# EAGLE design v1.3 (EAGLE 7.3.0)
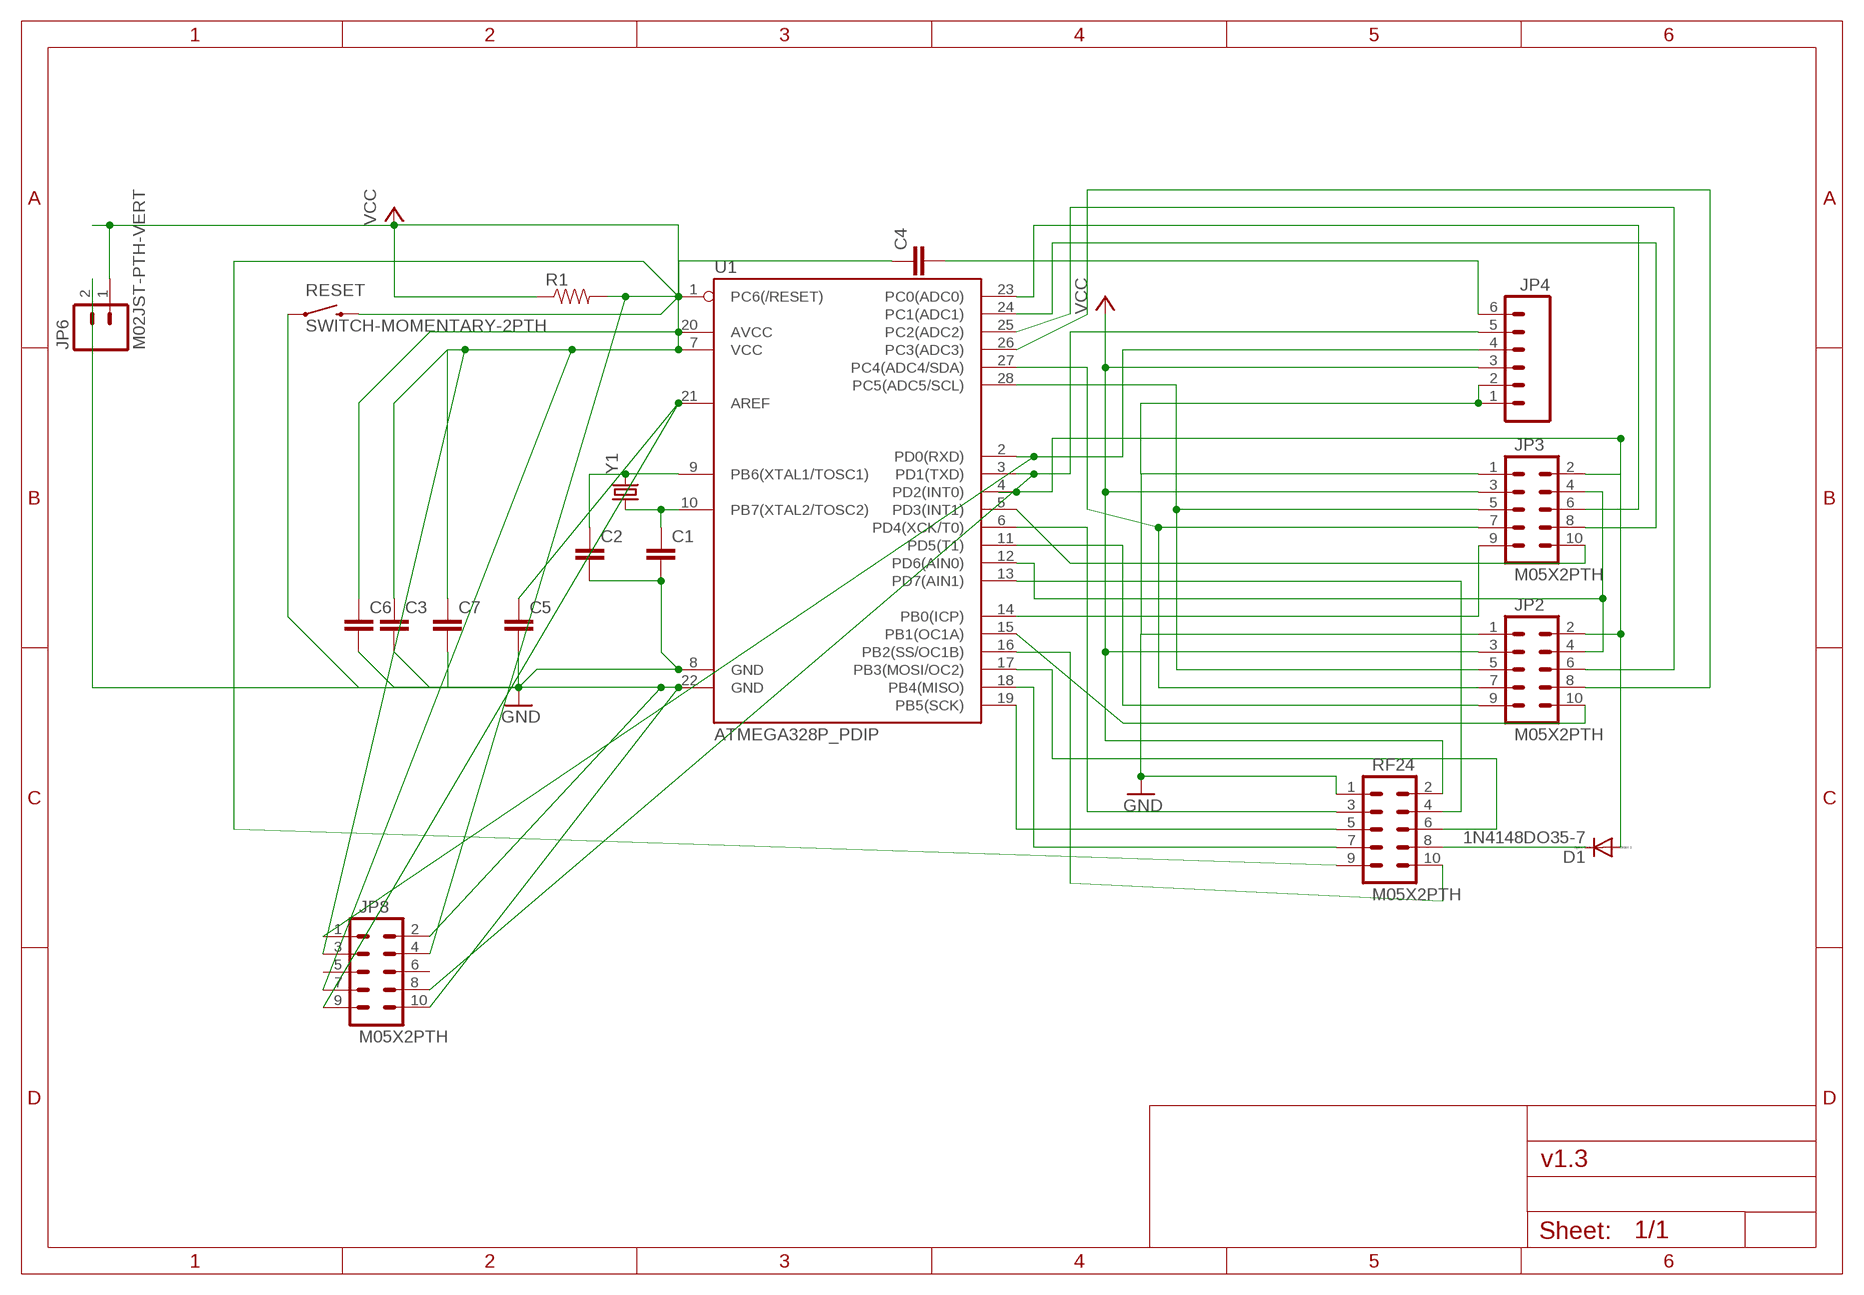
[diagram p0: schematic, sheet 1]

## Parts
C1  CAPPTH  [CAP-PTH-SMALL]
C2  CAPPTH  [CAP-PTH-SMALL]
C3  CAPPTH  [CAP-PTH-SMALL]
C4  CAPPTH  [CAP-PTH-SMALL]
C5  CAPPTH  [CAP-PTH-SMALL]
C6  CAPPTH  [CAP-PTH-SMALL]
C7  CAPPTH  [CAP-PTH-SMALL]
D1  1N4148DO35-7  [DO35-7]
JP2  M05X2PTH  [AVR_ICSP]
JP3  M05X2PTH  [AVR_ICSP]
JP4  M06SILK_FEMALE_PTH  [1X06]
JP6  M02JST-PTH-VERT  [JST-2-PTH-VERT]
JP8  M05X2PTH  [AVR_ICSP]
R1  RESISTORAXIAL-0.3  [AXIAL-0.3]
RESET  SWITCH-MOMENTARY-2PTH  [TACTILE-PTH]
RF24  M05X2PTH  [AVR_ICSP]
U1  ATMEGA328P_PDIP  [DIL28-3]
Y1  CRYSTALHC49US  [HC49US]

## Nets
GND: C1.2 C2.2 C3.2 C5.2 C6.2 C7.2 JP2.1 JP3.1 JP4.1 JP4.2 JP6.2 JP8.2 JP8.10 RESET.1 RF24.1 U1.8(GND) U1.22(GND)
N$1: C2.1 U1.9(PB6(XTAL1/TOSC1)) Y1.2
N$2: C4.1 JP8.4 R1.P$2 RESET.3 RF24.9 U1.1(PC6(/RESET))
N$3: C1.1 U1.10(PB7(XTAL2/TOSC2)) Y1.1
N$4: RF24.10 U1.16(PB2(SS/OC1B))
N$5: JP2.4 JP3.4 U1.12(PD6(AIN0))
N$6: C5.1 JP8.9 U1.21(AREF)
N$9: JP3.9 U1.14(PB0(ICP))
N$10: D1.A JP2.2 JP3.2 U1.4(PD2(INT0))
N$11: JP3.6 U1.23(PC0(ADC0))
N$12: JP3.8 U1.24(PC1(ADC1))
N$13: C4.2 JP4.6
N$14: JP2.6 U1.25(PC2(ADC2))
N$15: JP2.8 U1.26(PC3(ADC3))
N$16: RF24.6 U1.17(PB3(MOSI/OC2))
N$17: JP3.10 U1.5(PD3(INT1))
N$18: JP4.5 JP8.8 U1.3(PD1(TXD))
N$19: JP4.4 JP8.1 U1.2(PD0(RXD))
N$20: RF24.4 U1.13(PD7(AIN1))
N$21: JP2.5 JP3.5 U1.28(PC5(ADC5/SCL))
N$22: JP2.7 JP3.7 U1.27(PC4(ADC4/SDA))
N$23: RF24.5 U1.19(PB5(SCK))
N$24: D1.C RF24.8
N$25: RF24.3 U1.6(PD4(XCK/T0))
N$26: RF24.7 U1.18(PB4(MISO))
N$27: JP2.10 U1.15(PB1(OC1A))
N$28: JP2.9 U1.11(PD5(T1))
VCC: C3.1 C6.1 C7.1 JP2.3 JP3.3 JP4.3 JP6.1 JP8.3 JP8.7 R1.P$1 RF24.2 U1.7(VCC) U1.20(AVCC)
Unconnected: JP8.5 JP8.6

## Library data of the parts
C1-C7 = SparkFun-Passives:CAP: Capacitor Standard 0603 ceramic capacitor, and 0.1" leaded capacitor.
D1 = diode:1N4148: DIODE high speed (Philips)
JP2 JP3 JP8 RF24 = SparkFun-Connectors:M05X2: Header 5x2 Standard 10-pin dual row 0.1" header. Commonly used with AVR-ISP. Use with Spark Fun Electronics SKU: PRT-00778
JP4 = SparkFun-Connectors:M06: Header 6 Standard 6-pin 0.1" header. Use with straight break away headers (SKU : PRT-00116), right angle break away headers (PRT-00553), swiss pins (PRT-00743), machine pins (PRT-00117), and female headers (PRT-00115). Molex polarized connector foot print use with SKU : PRT-08094 with associated crimp pins and housings. NOTES ON THE VARIANTS LOCK and LOCK_LONGPADS... This footprint was designed to help hold the alignment of a through-hole component (i.e. 6-pin header) while soldering it into place. You may notice that each hole has been shifted either up or down by 0.005 of an inch from it's more standard position (which is a perfectly straight line). This slight alteration caused the pins (the squares in the middle) to touch the edges of the holes. Because they are alternating, it causes a "brace" to hold the component in place. 0.005 has proven to be the perfect amount of "off-center" position when using our standard breakaway headers. Although looks a little odd when you look at the bare footprint, once you have a header in there, the alteration is very hard to notice. Also,if you push a header all the way into place, it is covered up entirely on the bottom side. This idea of altering the position of holes to aid alignment will be further integrated into the Sparkfun Library for other footprints. It can help hold any component with 3 or more connection pins.; PROD_ID: CONN-08437
JP6 = SparkFun-Connectors:M02: Standard 2-pin 0.1" header. Use with - straight break away headers ( PRT-00116) - right angle break away headers (PRT-00553) - swiss pins (PRT-00743) - machine pins (PRT-00117) - female headers (PRT-00115) Molex polarized connector foot print use with: PRT-08233 with associated crimp pins and housings. 2.54_SCREWTERM for use with PRT-10571. 3.5mm Screw Terminal footprints for PRT-08084 5mm Screw Terminal footprints for use with PRT-08432
R1 = SparkFun-Passives:RESISTOR: Resistor Basic schematic elements and footprints for 0603, 1206, and PTH resistors.
RESET = SparkFun-Electromechanical:SWITCH-MOMENTARY-2: Various NO switches- pushbuttons, reed, etc
U1 = SparkFun-DigitalIC:ATMEGA328P_PDIP: uC used in the Arduino 32kb flash, 1k EEPROM, 2k SRAM This is the through-hole version of this chip.
Y1 = SparkFun-FreqCtrl:CRYSTAL: Various standard crystals. Proven footprints. Spark Fun Electronics SKU : COM-00534

## Net classes
0 default: clearance 0.205 mm

## Board
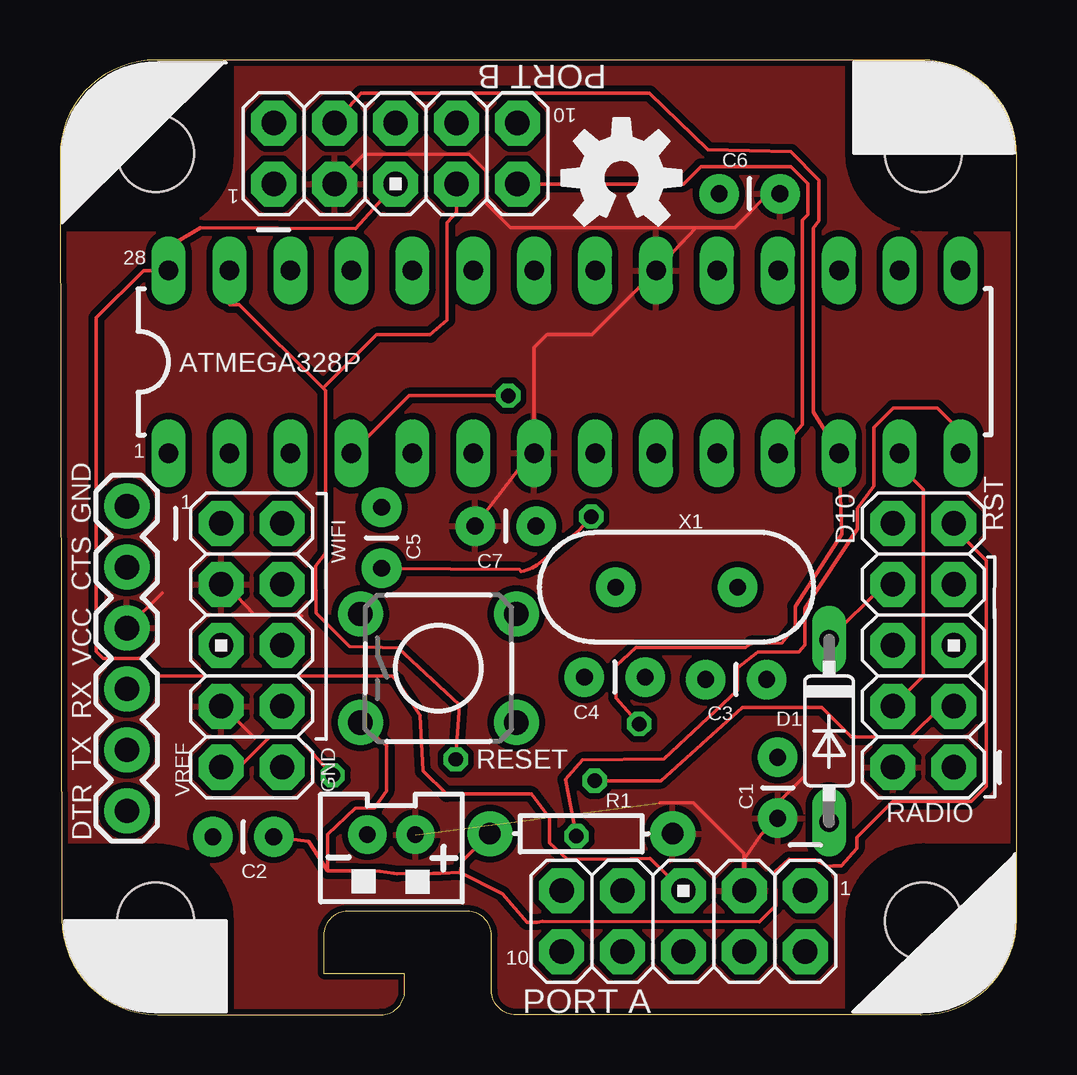
[diagram p1: board, top side]
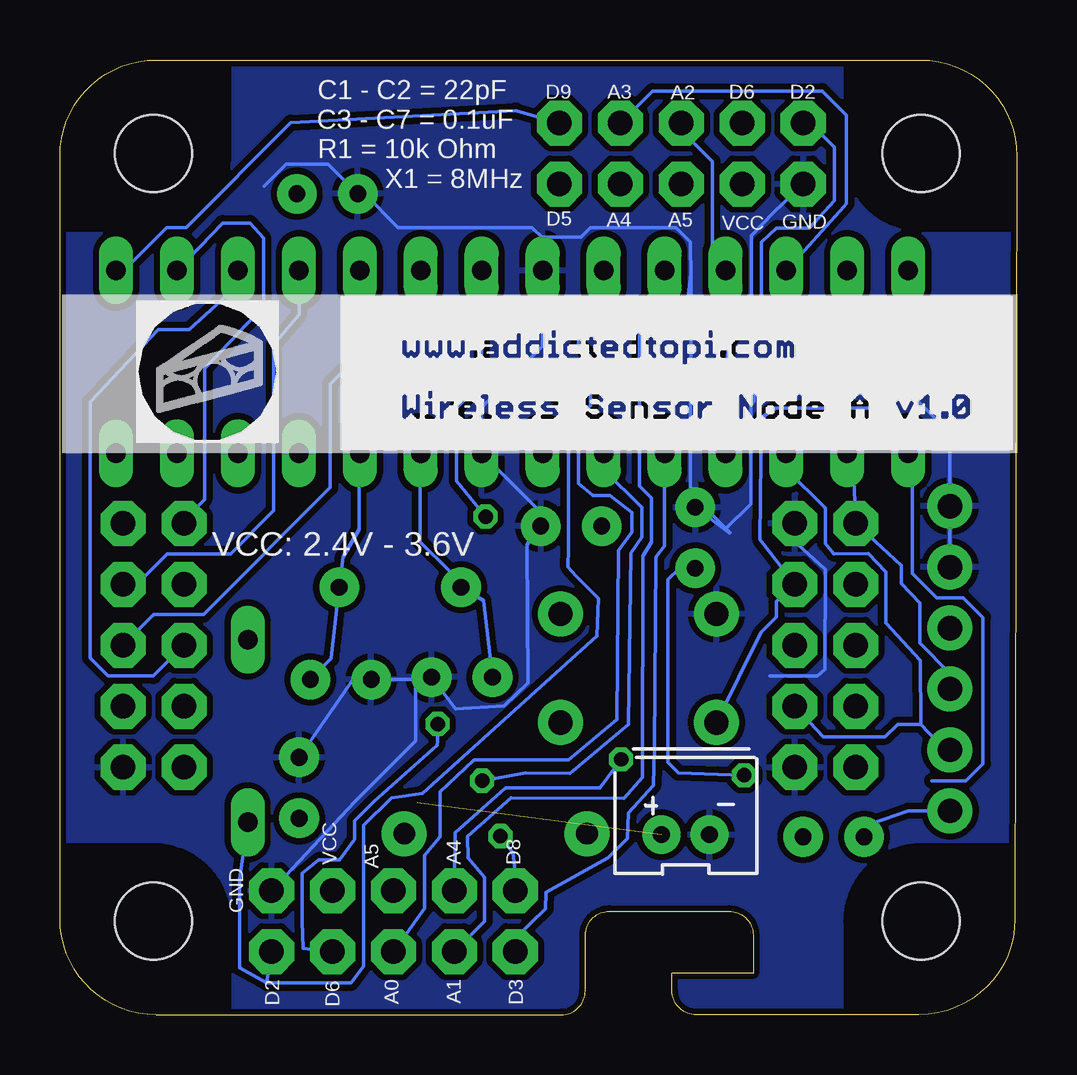
[diagram p2: board, bottom side, seen from below]

Size 39.89 x 39.8 mm. Coordinates in mm from the lower left corner, seen from the top.
Outline: 35.89,0 18.99,0 arc-90 17.99,1 17.99,3.31 arc90 16.99,4.31 11.99,4.31 arc90 10.99,3.31 10.99,1.74 14.37,1.74 14.37,1 arc-90 13.37,0 4.08,0 arc-90 0.08,3.99 0,35.79 arc-90 4,39.8 35.89,39.8 arc-90 39.89,35.8 39.89,4 arc-90 35.89,0
Copper layers (1*16): Top 0.035mm / dielectric 1.5mm / Bottom 0.035mm
Design rules "DFRobot_Eagle_Rule_v0.4": minimum track width 6mil, minimum drill 12mil, track to track 6mil, track to pad 6mil, pad to pad 6mil, via to via 6mil, smd to smd 0mil, copper to edge 10mil, drill to drill 10mil, minimum pad ring 12mil, minimum via ring 8mil, stop-mask expansion 2mil, vias tented up to drill 25mil, thermal gap 10mil

### Footprints (pad centres in the part's own frame; a part is rotated, then mirrored left to right if it is on the bottom)
CAP-PTH-SMALL = drill 0.7 pad 1.651: 1 0,0; 2 2.54,0
DO35-7 = drill 0.813 long: A 3.81,0; C -3.81,0
AVR_ICSP = drill 1.016 pad 1.88 octagon: 1 -1.27,5.08; 2 1.27,5.08; 3 -1.27,2.54; 4 1.27,2.54; 5 -1.27,0; 6 1.27,0; 7 -1.27,-2.54; 8 1.27,-2.54; 9 -1.27,-5.08; 10 1.27,-5.08
1X06 = drill 1.016 pad 1.88: 1 0,0; 2 2.54,0; 3 5.08,0; 4 7.62,0; 5 10.16,0; 6 12.7,0
JST-2-PTH-VERT = drill 0.7 pad 1.6: 1 -1,-0.55; 2 1,-0.55
AXIAL-0.3 = drill 0.9 pad 1.88: P$1 -3.81,0; P$2 3.81,0
TACTILE-PTH = drill 1.016 pad 1.88: 1 -3.251,2.261; 2 3.251,2.261; 3 -3.251,-2.261; 4 3.251,-2.261
DIL28-3 = drill 0.813 long: 1 -16.51,-3.81; 2 -13.97,-3.81; 3 -11.43,-3.81; 4 -8.89,-3.81; 5 -6.35,-3.81; 6 -3.81,-3.81; 7 -1.27,-3.81; 8 1.27,-3.81; 9 3.81,-3.81; 10 6.35,-3.81; 11 8.89,-3.81; 12 11.43,-3.81; 13 13.97,-3.81; 14 16.51,-3.81; 15 16.51,3.81; 16 13.97,3.81; 17 11.43,3.81; 18 8.89,3.81; 19 6.35,3.81; 20 3.81,3.81; 21 1.27,3.81; 22 -1.27,3.81; 23 -3.81,3.81; 24 -6.35,3.81; 25 -8.89,3.81; 26 -11.43,3.81; 27 -13.97,3.81; 28 -16.51,3.81
DP4040_V1_NOLINES = hole 3.2: -16,-16; 16,-16; 16,16; -16,16
HC49US = drill 0.7 pad 1.651: 1 -2.54,0; 2 2.54,0

### Placement (x,y rotation side)
C1  29.45,13.97 180 top
C2  21.86,14.07 0 top
C3  29.92,8.19 90 top
C4  8.91,7.41 180 top
C5  13.41,18.61 90 top
C6  30.02,34.22 180 top
C7  17.31,20.37 0 top
D1  32.06,11.83 270 top
JP2  13.99,35.9 90 top
JP3  25.99,3.9 270 top
JP4  2.79,21.2 270 top
JP6  13.82,6.95 180 top
JP8  7.99,15.4 0 top
R1  21.73,7.55 180 top
RESET  15.77,14.44 0 top
RF24  35.99,15.4 180 top
U1  21.04,27.22 0 top
U$1  [DP4040_V1_NOLINES]  19.99,19.9 0 top
U$5  [PI]  30.65,23.8 0 top
U$6  [OSHW-LOGO-M]  23.41,34.88 0 top
Y1  25.71,17.82 180 top

### Tracks (layer width: path | path; a pad name or v marks a point on that pad's centre or on a via)
GND
  Bottom 0.152: C2.2 23.41,12.75 21.38,12.88 20.38,13.82 20.41,19.58 20.08,20.13 C7.2 19.47,20.57 U1.8 22.34,23.44 22.34,25.3 19.77,27.87 U1.22 19.8,31.06 19.8,32.41 | JP4.2 JP4.1 2.79,24.24 4.43,25.88 10.84,25.88 10.96,25.76 10.96,25.55 11.09,25.4 11.09,21.29 12.13,20.27 | 19.8,32.41 20.21,32.82 25.8,32.82 27.2,34.22 C6.2 28.71,35.46 30.47,35.46 31.38,34.55 | C2.2 24.78,13.97 C1.2 27.68,13.97 C3.2 | JP3.1 27.59,8.9 25.07,11.42 25.07,13.68 C2.2 | 12.13,20.27 11.96,20.1 11.98,20.08 C5.2 | 12.13,20.27 13.6,21.74 13.59,30.89 | 13.59,30.89 13.6,32 13.6,32.2 14.21,32.82 17.77,32.82 18.18,32.41 19.8,32.41 | JP2.1 10.15,33.43 11.06,32.48 11.06,29.87 11.78,29.16 12.79,29.16 13.69,30.06 13.59,30.89 | JP8.2 9.39,19.84 7.99,18.57 8,14.39 8.32,14.13 10.3,14.12 10.15,14.12
  pour Bottom (isolate 0.254): 3.04,39.52 36.57,39.52 39.77,35.92 39.72,3.71 35.91,0.08 3.5,0.08 0.22,4.47 0.32,35.89
N$1
  Bottom 0.152: C2.1 22.24,17.27 Y1.2 23.7,18.53 24.88,19.71 24.88,23.38 U1.9
N$2
  Top 0.152: 16.68,5.95 18.46,5.03 19.47,3.86 19.88,3.86 20.11,3.89 29.15,3.88 29.78,4.49 29.83,4.55 29.83,5.98 30.38,6.47 31.5,6.47 31.98,6.19 32.22,6.2 32.58,6.2 33.21,6.94 33.21,7.39 34.72,8.9 37.99,8.9 38.61,9.52 38.61,18.94 37.26,20.29 RF24.9 | 16.68,5.95 15.86,5.89 15.56,5.89 14.06,5.87 13.93,5.89 13.34,5.97 12.35,6 11.17,6 | 16.68,5.95 16.8,6.43 R1.P$2 | C4.1 10.37,7.23 11.17,6 | RESET.3 12.52,12.13 13.6,11.23 13.6,9.32 13.11,8.62 12.29,8.6 11.17,7.52 11.17,6
  Bottom 0.152: 3.55,9.76 2.12,9.76 1.41,10.47 1.41,16.56 2.22,17.38 3.34,17.38 4.36,18.39 4.36,23.24 U1.1 4.53,23.74 6.09,25.3 10.05,25.3 10.66,24.89 10.71,19.82 JP8.4 10.02,17.22 10.02,16.59 10.67,15.94 RESET.3
N$3
  Bottom 0.152: C1.1 28.58,14.85 Y1.1 28.1,19.09 27.42,20.22 27.42,23.38 U1.10
N$4
  Bottom 0.152: U1.16 33.12,33 31.97,33 31.41,32.37 31.41,29.55 33.86,26.93 33.86,21.48 34.72,20.62 RF24.10
N$5  (via drill 0.6)
  Top 0.152: v24.14,12.12 23.18,13.21 23.18,14.53 24.02,15.32 28.56,15.32 28.82,15.47 28.87,15.47 30.09,15.5 30.65,16.21 30.65,17.02 32.6,20.04 32.47,23.24 U1.12 31.41,25.13 31.41,32.79 31.64,33.1 31.64,34.8 30.47,35.97 27.02,36.07 24.58,38.41 12.55,38.41 JP2.4
  Bottom 0.152: v24.14,12.12 24.14,11.39 24.18,11.24 26.79,8.9 27.6,8.08 27.6,7.32 28.23,6.45 29.1,6.45 29.79,5.9 29.79,3.9 29.76,2.76 JP3.4
N$6  (via drill 0.6)
  Top 0.152: v22.15,20.76 21.64,20.19 20.08,18.9 arc-36 19.22,18.49 19.15,18.55 C5.1 | JP8.9 7.54,10.38 8.74,11.58 9.91,11.58 v11.37,9.98
  Bottom 0.152: U1.21 22.31,26.35 23.36,25.3 23.36,22.25 v22.15,20.76 | C5.1 14.07,18.61 14.54,18.14 14.54,10.52 14.11,10.09 v11.37,9.98
N$9  (via drill 0.6)
  Top 0.152: U1.14 37.55,24.32 36.57,25.3 34.74,25.3 33.92,24.49 33.92,22.05 33.24,21.11 33.24,20.24 31.05,16.94 31.05,15.42 30.8,15.12 29.1,15.12 28.23,14.45 28.23,13.51 25.19,10.67 21.78,10.62 21.07,9.81 v21.53,7.44
  Bottom 0.152: JP3.9 20.92,6 21,6.74 v21.53,7.44
N$10  (via drill 0.6)
  Top 0.152: v18.68,25.81 14.55,25.81 U1.4
  Bottom 0.152: JP3.2 31.27,1.33 | 31.27,1.33 32.41,1.96 32.41,5.67 D1.A | U1.4 12.05,28.01 10.66,29.67 10.66,32.21 10.02,32.79 8.65,32.79 7.61,33.94 7.61,36.17 8.61,37.17 JP2.2 | 31.27,1.33 27.76,1.32 27.23,2.02 27.22,7.89 26.07,9.04 24.78,9.22 17.5,15.8 17.44,17.35 18.38,18.29 18.71,18.67 18.68,19.46 v18.68,25.81
N$11
  Bottom 0.152: U1.23 17.23,30.41 18.28,29.36 18.28,27.94 17.77,27.43 17.77,25.4 18.28,24.89 18.28,22.15 17.67,21.64 16.96,21.64 16.04,20.93 16.04,20.12 16.6,19.36 16.68,12.32 18.68,10.62 22.62,10.62 24.04,9.3 24.04,7.42 24.69,6.65 24.69,4.43 JP3.6
N$12
  Bottom 0.152: U1.24 14.69,30.61 15.74,29.57 15.74,22.05 15.23,21.54 15.23,19.71 15.59,19.13 15.61,9.88 16.37,9.02 21.09,9.03 22.89,7.43 22.87,6.53 22.19,5.73 22.19,3.9 JP3.8
N$13
  Bottom 0.152: JP4.6 4.53,8.5 6.09,7.96 6.09,7.86 C4.2
N$14
  Bottom 0.152: U1.25 12.69,31.57 12.69,35.56 13.99,36.86 JP2.6
N$15
  Bottom 0.152: U1.26 7.22,33.69 7.1,33.81 7.1,37.49 8.12,38.51 15.19,38.51 JP2.8
N$16
  Bottom 0.152: U1.17 32.47,30.41 34.51,28.55 35.81,28.55 38.63,25.55 38.63,14.88 37.87,14.12 36,14.12 RF24.6
N$17
  Bottom 0.152: U1.5 14.69,19.54 15.05,19.08 15.1,11.1 15.15,9.55 16.19,8.41 16.24,7.35 17.05,6.54 19.62,5.11 19.65,4.42 20.92,3.18 JP3.10
N$18
  Bottom 0.152: JP4.5 3,11.04 4,12.09 | 4,12.09 4.03,14.76 5.46,16.34 5.46,18.46 6.19,19.22 7.62,19.21 7.99,19.64 7.99,21.12 9.61,22.73 U1.3 | JP8.8 8.07,11.59 5.5,11.59 4.97,12.09 4,12.09
N$19
  Bottom 0.152: JP4.4 2.79,14.23 4.05,15.5 4.05,17.17 4.82,17.98 4.82,18.72 JP8.1 6.85,23.18 U1.2
N$20
  Top 0.152: RF24.4 35.99,14.13 35.99,21.9 35.01,22.88 U1.13
N$21
  Top 0.152: JP3.5 24.59,6.52 23.79,6.5 21.15,6.48 20.41,7.16 20.41,8.21 19.65,9.2 16.12,9.2 15.13,10.16 15,12.47 14.06,13.92 13.83,14.12 4.11,14.12 3.39,14.86 1.79,14.86 1.51,15.14 1.51,29.06 3.48,31.03 U1.28 4.7,31.03 4.7,32.07 4.79,32.16 5.87,32.8 12.31,32.78 JP2.5
N$22  (via drill 0.6)
  Top 0.152: 10.96,26.11 7.48,29.6 7.07,29.6 U1.27 | 10.96,26.11 11.06,26.01 11.06,19.25 10.66,18.7 10.68,16.74 12.08,15.34 14.09,15.29 16.65,12.91 v16.5,10.64 | 10.96,26.11 13.2,28.35 15.43,28.35 16.14,28.96 16.14,33.02 16.53,33.45 JP2.7
  Bottom 0.152: JP3.7 23.42,7.58 21.33,9.45 17.39,9.45 v16.5,10.64
N$23
  Bottom 0.152: U1.19 27.39,27.51 28.62,26.28 28.62,21.97 33.91,16.68 35.98,16.68 RF24.5
N$24
  Top 0.152: D1.C 34.36,17.94 RF24.8
N$25  (via drill 0.6)
  Top 0.152: v22.29,9.76 25.06,9.76 28.44,12.8 31.76,12.8 32.99,11.58 35.45,11.58 36.73,12.86 RF24.3
  Bottom 0.152: U1.6 17.23,22.73 15.64,21.13 15.64,19.91 16.09,19.25 16.19,12.09 18.63,10.06 20.49,10.09 v22.29,9.76
N$26
  Bottom 0.152: U1.18 29.93,29.19 30.98,27.94 30.98,21.01 32.78,19.21 35.42,19.21 36.69,17.94 RF24.7
N$27
  Bottom 0.152: U1.15 37.24,31.03 35.45,32.82 34.64,32.82 30.27,37.19 20.89,37.69 JP2.10
N$28
  Top 0.152: JP2.9 25.98,34.63 26.71,35.36 30.47,35.36 31.18,34.65 31.18,33.35 30.95,33.12 30.95,24.61 U1.11
VCC  (1 unrouted)
  Top 0.152: U1.20 22.17,28.35 20.31,28.35 19.77,27.81 U1.7 19.64,23.41 C7.1 | 24.92,31.03 24.92,31.13 26.51,32.82 | 26.51,32.82 28.13,32.82 29.45,34.14 29.93,34.14 C6.1 | 4.26,17.59 JP4.3 | 30.99,9.9 29.92,8.83 C3.1 29.22,7.49 28.53,6.49 JP3.3 28.51,6.63 28.51,6.73 26.41,8.84 25.01,8.84 | 26.51,32.82 26.41,32.82 18.79,32.82 17.77,33.83 17.77,35.16 17.06,35.87 12.69,35.87 JP2.3 | 6.85,12.85 JP8.7 6.87,12.78 8.12,11.53 | JP8.3 7,17.86 8.1,16.68 9.82,16.68 10.07,16.61
  pour Top (isolate 0.254): 35.61,-0.1 3.99,-0.1 arc-90 -0.01,3.9 -0.01,35.52 arc-90 3.99,39.52 35.61,39.52 arc-90 39.61,35.52 39.61,3.9 arc-90

### Text on the board
tPlace: PORT B | 10 | 1 | C6 | 28 | ATMEGA328P | 1 | GND | 1 | X1 | D10 | RST | WIFI | C5 | C7 | CTS | VCC | RX | C4 | C3 | D1 | TX | RESET | VREF | GND | R1 | C1 | RADIO | DTR | C2 | 1 | 10 | PORT A
bPlace: D2 | D6 | A2 | A3 | D9 | C1 - C2 = 22pF | C3 - C7 = 0.1uF | R1 = 10k Ohm | X1 = 8MHz | GND | VCC | A5 | A4 | D5 | VCC: 2.4V - 3.6V | D8 | A4 | A5 | VCC | GND | D3 | A1 | A0 | D6 | D2